# EAGLE schematic pwm-board (EAGLE 4.16)
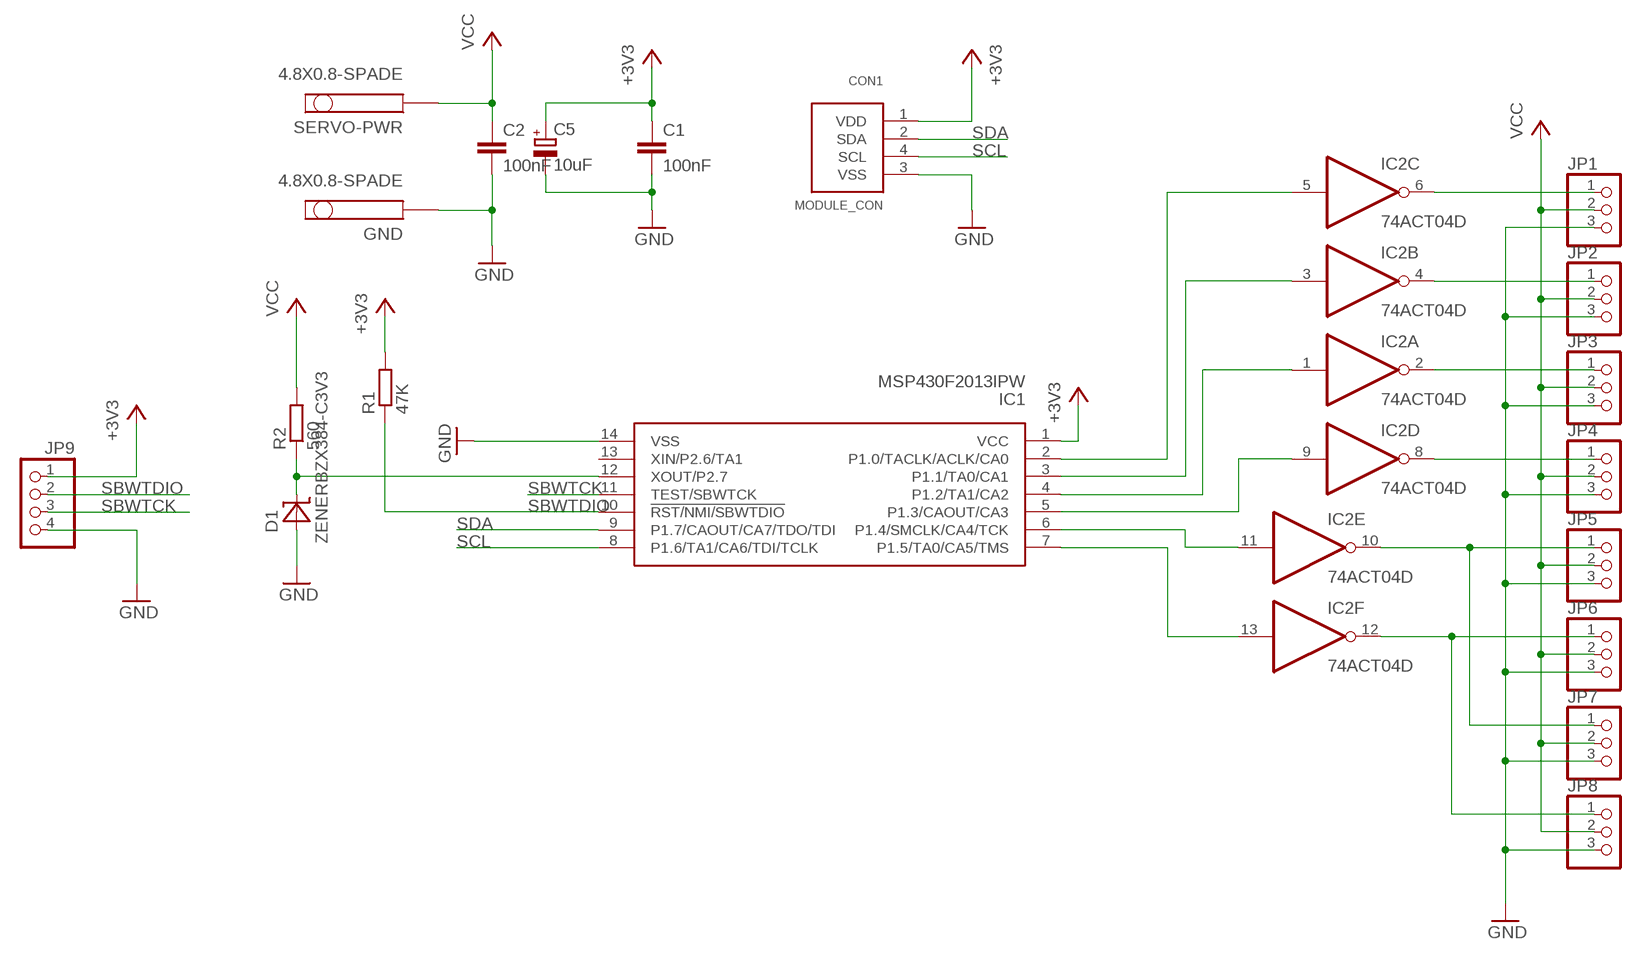
[diagram p0: schematic, sheet 1]

## Parts
C1  100nF  C-EUC0603K  [C0603K]
C2  100nF  C-EUC0603K  [C0603K]
C5  10uF  CPOL-EUE2-4_0.6MMDRILL  [E2-4_0.6MMDRILL]
CON1  MODULE_CON  [RJ11-4P4C]
D1  ZENERBZX384-C3V3  [SOD323-W]
GND  4.8X0.8-SPADE  [SPADE]
IC1  MSP430F2013IPW  [TSSOP14]
IC2  74ACT04D  [SO14]
JP1  PINHD-1X3  [1X03]
JP2  PINHD-1X3  [1X03]
JP3  PINHD-1X3  [1X03]
JP4  PINHD-1X3  [1X03]
JP5  PINHD-1X3  [1X03]
JP6  PINHD-1X3  [1X03]
JP7  PINHD-1X3  [1X03]
JP8  PINHD-1X3  [1X03]
JP9  PINHD-1X4  [1X04]
R1  47K  R-EU_R0603  [R0603]
R2  560  R-EU_R0603  [R0603]
SERVO-PWR  4.8X0.8-SPADE  [SPADE]

## Nets
+3V3: C1.1 C5.+ CON1.1(VDD) IC1.1(VCC) JP9.1 R1.2
GND: C1.2 C2.2 C5.- CON1.3(VSS) D1.A GND.P$1 IC1.14(VSS) JP1.3 JP2.3 JP3.3 JP4.3 JP5.3 JP6.3 JP7.3 JP8.3 JP9.4
N$1: IC2.10(E:O) JP5.1 JP7.1
N$2: IC2.12(F:O) JP6.1 JP8.1
N$3: D1.C IC1.12(XOUT/P2.7) R2.1
N$6: IC1.2(P1.0/TACLK/ACLK/CA0) IC2.5(C:I)
N$10: IC1.3(P1.1/TA0/CA1) IC2.3(B:I)
N$11: IC1.4(P1.2/TA1/CA2) IC2.1(A:I)
N$12: IC1.5(P1.3/CAOUT/CA3) IC2.9(D:I)
N$15: IC2.6(C:O) JP1.1
N$16: IC2.4(B:O) JP2.1
N$17: IC2.2(A:O) JP3.1
N$19: IC2.8(D:O) JP4.1
SBWTCK: IC1.11(TEST/SBWTCK) JP9.3
SBWTDIO: IC1.10(!RST/NMI/SBWTDIO) JP9.2 R1.1
SCL: CON1.4(SCL) IC1.8(P1.6/TA1/CA6/TDI/TCLK)
SDA: CON1.2(SDA) IC1.9(P1.7/CAOUT/CA7/TDO/TDI)
TCK: IC1.6(P1.4/SMCLK/CA4/TCK) IC2.11(E:I)
TMS: IC1.7(P1.5/TA0/CA5/TMS) IC2.13(F:I)
VCC: C2.1 JP1.2 JP2.2 JP3.2 JP4.2 JP5.2 JP6.2 JP7.2 JP8.2 R2.2 SERVO-PWR.P$1
Unconnected: IC1.13(XIN/P2.6/TA1)

## Power pins joined to a net without a drawn wire
GND: IC2.7(P:GND)
VCC: IC2.14(P:VCC)

## Library data of the parts
C1 C2 = rcl:C-EU: CAPACITOR, European symbol
C5 = ecssr:CPOL-EU: POLARIZED CAPACITOR, European symbol
CON1 = ecssr:MODULE_CON
D1 = ecssr:ZENER
GND SERVO-PWR = ecssr-Pwr:4.8X0.8-SPADE
IC1 = ecssr:MSP430F2013
IC2 = 74xx-eu:74*04: Hex INVERTER
JP1-JP8 = pinhead:PINHD-1X3: PIN HEADER
JP9 = pinhead:PINHD-1X4: PIN HEADER
R1 R2 = rcl:R-EU_: RESISTOR, European symbol